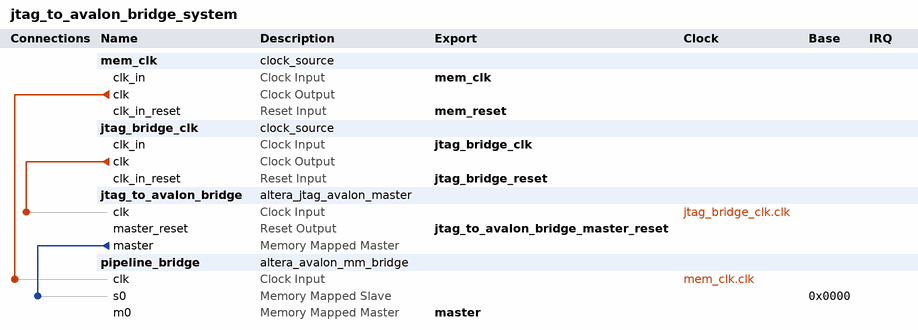
[diagram p0: system contents]
# Platform Designer (Qsys) system jtag_to_avalon_bridge_system
# Parameters at their usual value, and those the tool derives, are not listed.
package require -exact qsys 10.1
create_system jtag_to_avalon_bridge_system
set_project_property DEVICE_FAMILY CYCLONEIII

add_instance mem_clk clock_source 10.1
set_instance_parameter_value mem_clk clockFrequency 50000000
set_instance_parameter_value mem_clk clockFrequencyKnown false

add_instance jtag_bridge_clk clock_source 10.1
set_instance_parameter_value jtag_bridge_clk clockFrequency 50000000
set_instance_parameter_value jtag_bridge_clk clockFrequencyKnown false

add_instance jtag_to_avalon_bridge altera_jtag_avalon_master 10.1

add_instance pipeline_bridge altera_avalon_mm_bridge 10.1
set_instance_parameter_value pipeline_bridge DATA_WIDTH 32
set_instance_parameter_value pipeline_bridge ADDRESS_WIDTH 16
set_instance_parameter_value pipeline_bridge ADDRESS_UNITS SYMBOLS
set_instance_parameter_value pipeline_bridge BURSTCOUNT_UNITS SYMBOLS
set_instance_parameter_value pipeline_bridge MAX_PENDING_RESPONSES 1

# connections
add_connection jtag_bridge_clk.clk jtag_to_avalon_bridge.clk clock
add_connection mem_clk.clk pipeline_bridge.clk clock
add_connection jtag_to_avalon_bridge.master pipeline_bridge.s0 avalon
set_connection_parameter_value jtag_to_avalon_bridge.master/pipeline_bridge.s0 baseAddress 0x0000

# exported interfaces
add_interface jtag_bridge_clk clock sink
set_interface_property jtag_bridge_clk EXPORT_OF jtag_bridge_clk.clk_in
add_interface jtag_bridge_reset reset sink
set_interface_property jtag_bridge_reset EXPORT_OF jtag_bridge_clk.clk_in_reset
add_interface mem_clk clock sink
set_interface_property mem_clk EXPORT_OF mem_clk.clk_in
add_interface mem_reset reset sink
set_interface_property mem_reset EXPORT_OF mem_clk.clk_in_reset
add_interface master avalon master
set_interface_property master EXPORT_OF pipeline_bridge.m0
add_interface jtag_to_avalon_bridge_master_reset reset source
set_interface_property jtag_to_avalon_bridge_master_reset EXPORT_OF jtag_to_avalon_bridge.master_reset

save_system jtag_to_avalon_bridge_system.qsys
